# Altium schematic sheet Block Diagram.SchDoc
size A; Engineer: Cengizhan Kahraman; SheetNumber: 2; SheetTotal: 5
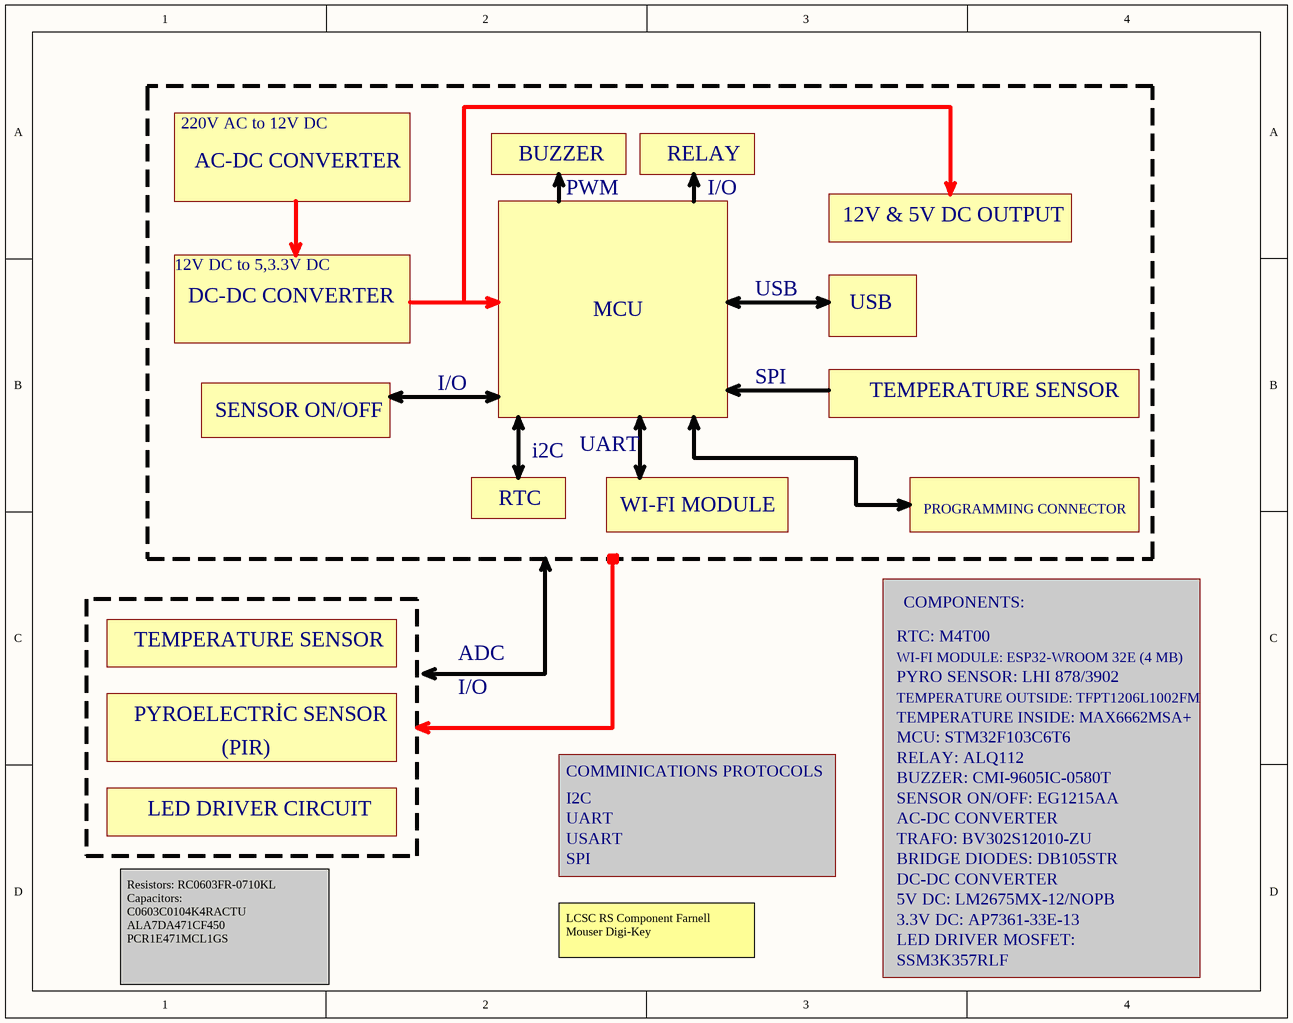
[diagram p0: Block Diagram.SchDoc]

## Notes on the sheet
- 220V AC to 12V DC
- BUZZER
- RELAY
- AC-DC CONVERTER
- PWM
- I/O
- 12V & 5V DC OUTPUT
- 12V DC to 5,3.3V DC
- USB
- DC-DC CONVERTER
- MCU
- SENSOR ON/OFF
- SPI
- TEMPERATURE SENSOR
- RTC
- i2C
- UART
- WI-FI MODULE
- PROGRAMMING CONNECTOR
- RTC: M4T00
- COMPONENTS:
- ADC
- WI-FI MODULE: ESP32-WROOM 32E (4 MB)
- PYRO SENSOR: LHI 878/3902
- TEMPERATURE OUTSIDE: TFPT1206L1002FM
- PYROELECTRİC SENSOR
- (PIR)
- COMMINICATIONS PROTOCOLS
- TEMPERATURE INSIDE: MAX6662MSA+
- MCU: STM32F103C6T6
- RELAY: ALQ112
- LED DRIVER CIRCUIT
- I2C
- BUZZER: CMI-9605IC-0580T
- SENSOR ON/OFF: EG1215AA
- USART
- TRAFO: BV302S12010-ZU
- BRIDGE DIODES: DB105STR
- 5V DC: LM2675MX-12/NOPB
- LCSC RS Component Farnell Mouser Digi-Key
- LED DRIVER MOSFET:
- SSM3K357RLF
- 3.3V DC: AP7361-33E-13
- Resistors: RC0603FR-0710KL
  Capacitors:
  C0603C0104K4RACTU
  ALA7DA471CF450
  PCR1E471MCL1GS